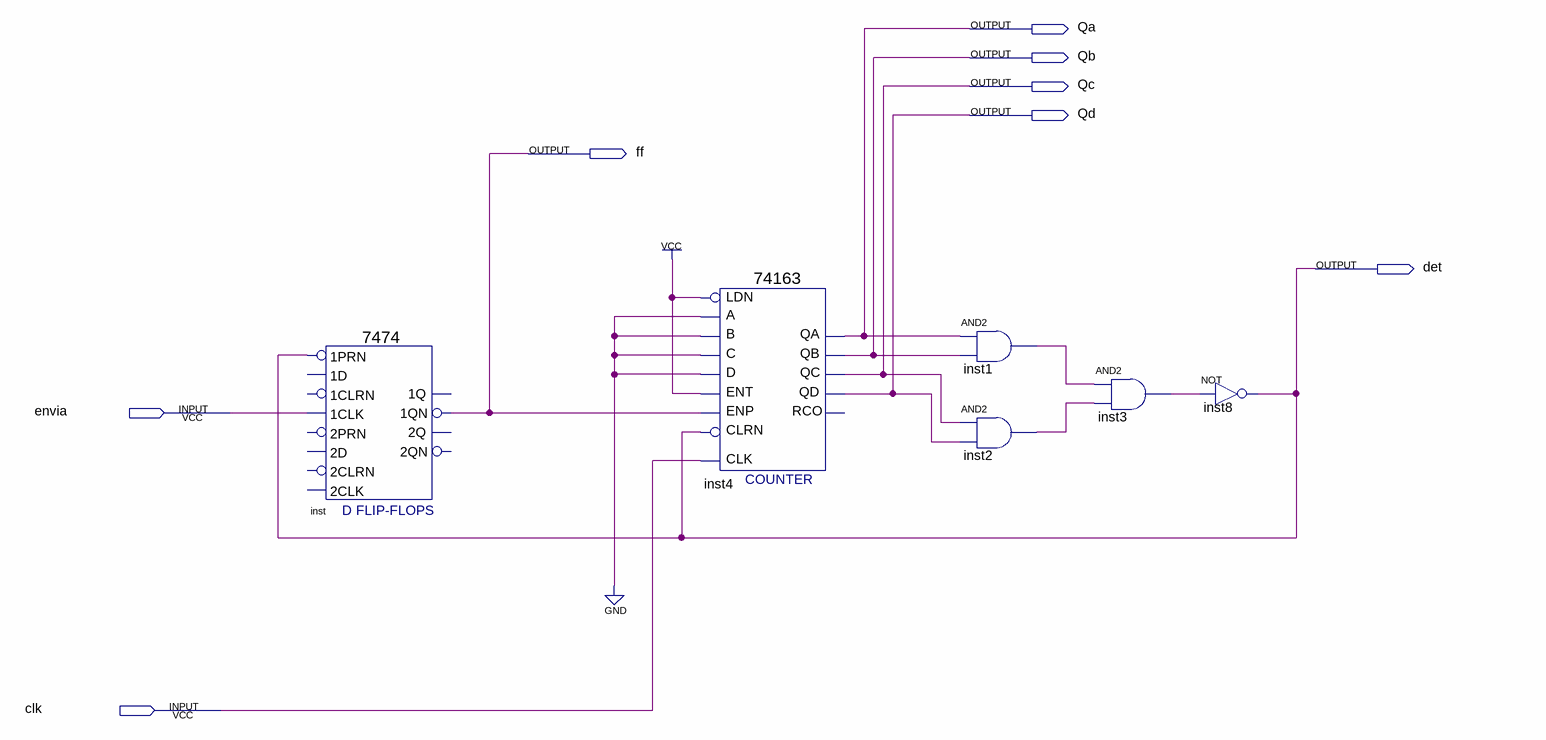
[diagram p0: schematic sheet]
// Quartus schematic teste.bdf as structural Verilog: 6 symbols, 8 pins
module teste (
  input  envia,
  input  clk,
  output Qa,
  output Qb,
  output Qc,
  output Qd,
  output ff,
  output det
);

  wire inst1_out, inst2_out, inst3_out;

  \7474  inst (.\1CLK (envia), .\1PRN (det), .\1QN (ff));  // open: 2D, 2PRN, 1D, 2CLK, 2CLRN, 1CLRN, 2Q, 2QN, 1Q
  \74163  inst4 (
    .C(1'b0), .B(1'b0), .A(1'b0), .ENT(1'b1), .D(1'b0), .CLRN(det), .CLK(clk), .ENP(ff), .LDN(1'b1), .QA(Qa),
    .QB(Qb), .QC(Qc), .QD(Qd));  // open: RCO
  and inst1 (inst1_out, Qa, Qb);
  and inst2 (inst2_out, Qc, Qd);
  and inst3 (inst3_out, inst1_out, inst2_out);
  not inst8 (det, inst3_out);
endmodule
